# EAGLE schematic ETRX357 (EAGLE 6.2)
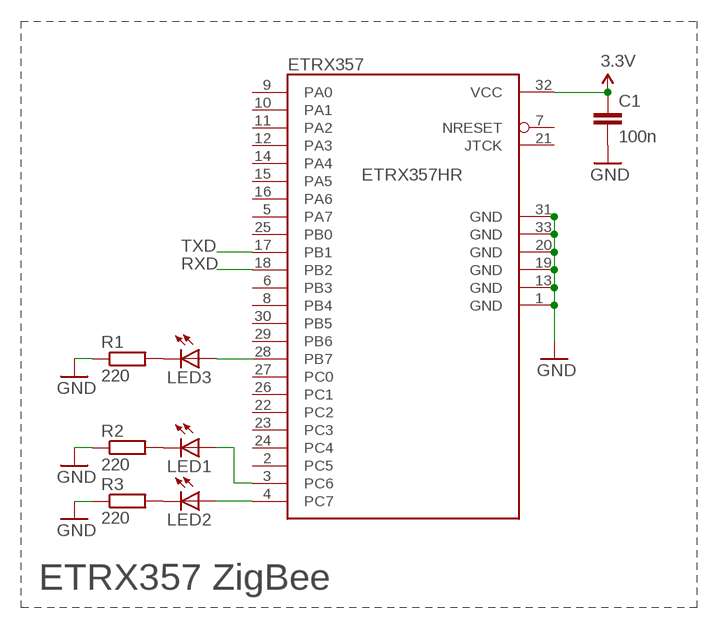
[diagram p0: schematic, sheet 1]

## Parts
C1  100n  C-EUC0805  [C0805]
ETRX357  ETRX357HR  [ETRX3]
LED1  LED1206  [LED-1206]
LED2  LED1206  [LED-1206]
LED3  LED1206  [LED-1206]
R1  220  R-EU_M0805  [M0805]
R2  220  R-EU_M0805  [M0805]
R3  220  R-EU_M0805  [M0805]

## Nets
3.3V: C1.1 ETRX357.32(VCC)
GND: C1.2 ETRX357.1(GND) ETRX357.13(GND) ETRX357.19(GND) ETRX357.20(GND) ETRX357.31(GND) ETRX357.33(GND) R1.1 R2.1 R3.1
N$1: ETRX357.3(PC6) LED1.A
N$2: ETRX357.4(PC7) LED2.A
N$3: ETRX357.28(PB7) LED3.A
N$4: LED3.C R1.2
N$5: LED1.C R2.2
N$6: LED2.C R3.2
RXD: ETRX357.18(PB2)
TXD: ETRX357.17(PB1)
Unconnected: ETRX357.2(PC5) ETRX357.5(PA7) ETRX357.6(PB3) ETRX357.7(NRESET) ETRX357.8(PB4) ETRX357.9(PA0) ETRX357.10(PA1) ETRX357.11(PA2) ETRX357.12(PA3) ETRX357.14(PA4) ETRX357.15(PA5) ETRX357.16(PA6) ETRX357.21(JTCK) ETRX357.22(PC2) ETRX357.23(PC3) ETRX357.24(PC4) ETRX357.25(PB0) ETRX357.26(PC1) ETRX357.27(PC0) ETRX357.29(PB6) ETRX357.30(PB5)

## Notes on the sheet
- ETRX357 ZigBee

## Library data of the parts
C1 = rcl:C-EU: CAPACITOR, European symbol
ETRX357 = etrx357_logical:ETRX357*: ETRX357 or ETRX351. Pins arranged logically
LED1-LED3 = SparkFun-LED (1):LED: LEDs Standard schematic elements and footprints for 5mm, 3mm, 1206, and 0603 sized LEDs. 5mm - Spark Fun Electronics SKU : COM-00529 (and others)
R1-R3 = rcl:R-EU_: RESISTOR, European symbol